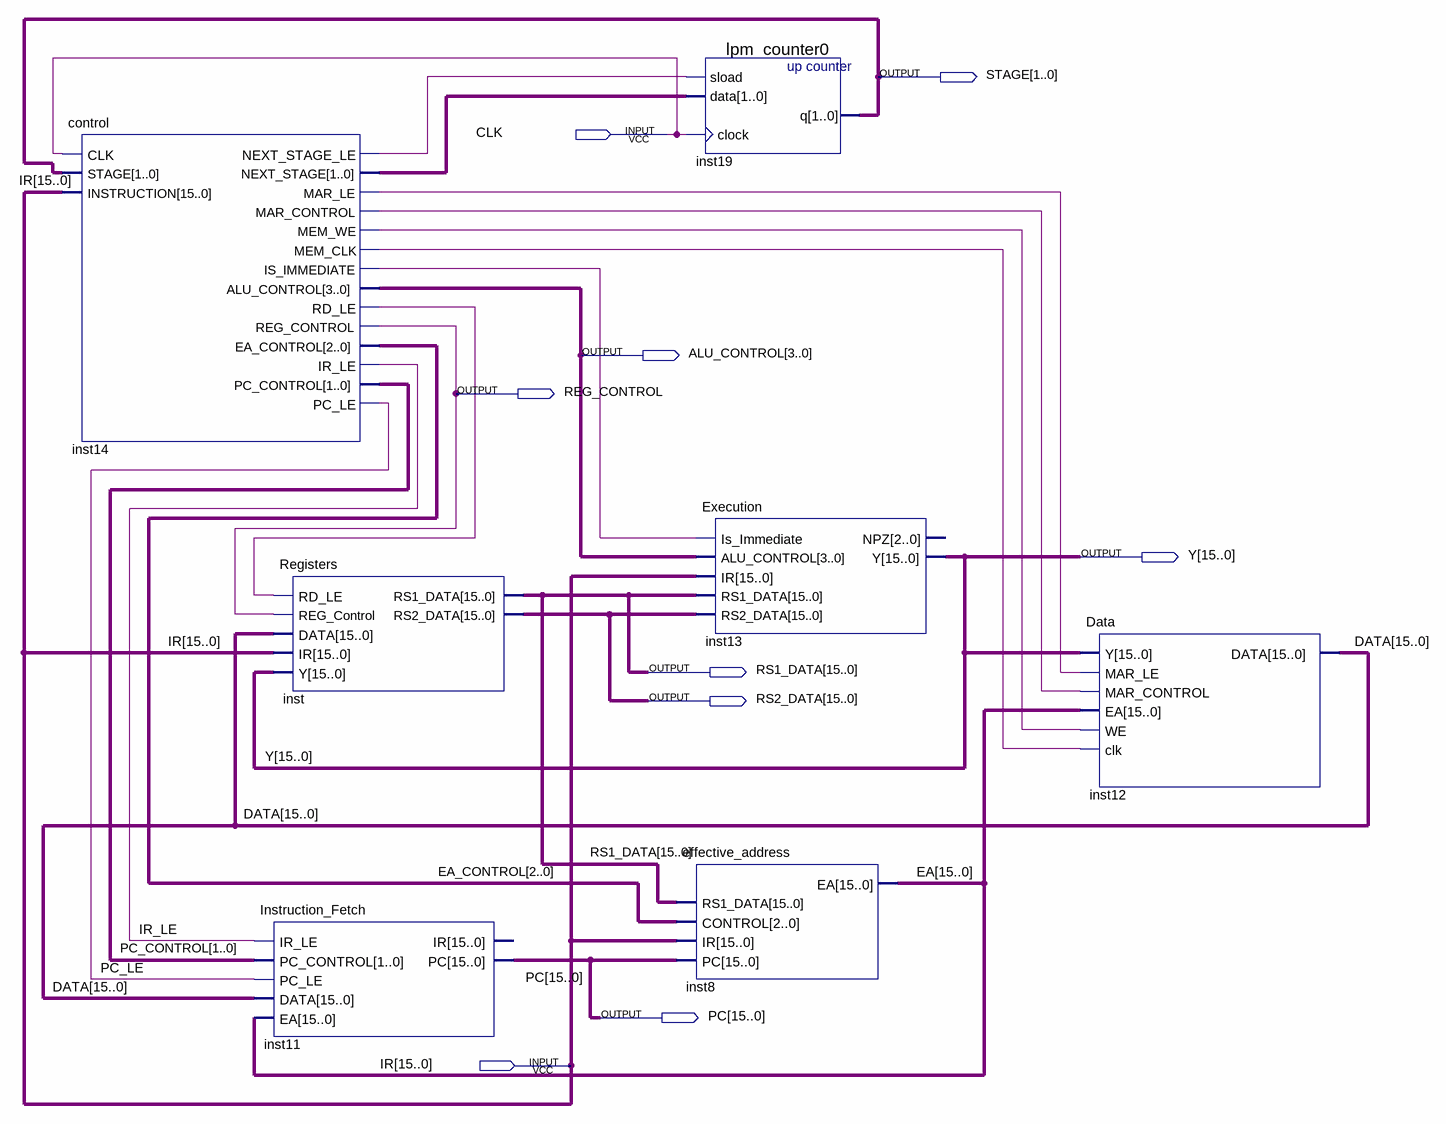
[diagram p0: schematic sheet]
// Quartus schematic LC3.bdf as structural Verilog: 7 symbols, 9 pins
module LC3 (
  input  CLK,
  input  [15:0] IR,
  output [1:0] STAGE,
  output [3:0] ALU_CONTROL,
  output REG_CONTROL,
  output [15:0] Y,
  output [15:0] RS1_DATA,
  output [15:0] RS2_DATA,
  output [15:0] PC
);

  wire inst14_is_immediate, inst14_mar_control, inst14_mar_le, inst14_mem_clk, inst14_mem_we,
       inst14_next_stage_le, inst14_rd_le, IR_LE, PC_LE;
  wire [1:0] inst14_next_stage, PC_CONTROL;
  wire [2:0] EA_CONTROL;
  wire [15:0] DATA, EA;

  control inst14 (
    .CLK(CLK), .STAGE(STAGE), .INSTRUCTION(IR), .NEXT_STAGE_LE(inst14_next_stage_le),
    .NEXT_STAGE(inst14_next_stage), .MAR_LE(inst14_mar_le), .MAR_CONTROL(inst14_mar_control),
    .MEM_WE(inst14_mem_we), .MEM_CLK(inst14_mem_clk), .IS_IMMEDIATE(inst14_is_immediate),
    .ALU_CONTROL(ALU_CONTROL), .RD_LE(inst14_rd_le), .REG_CONTROL(REG_CONTROL), .EA_CONTROL(EA_CONTROL),
    .IR_LE(IR_LE), .PC_CONTROL(PC_CONTROL), .PC_LE(PC_LE));
  Instruction_Fetch inst11 (
    .IR_LE(IR_LE), .PC_CONTROL(PC_CONTROL), .PC_LE(PC_LE), .EA(EA), .DATA(DATA), .PC(PC));  // open: IR
  Registers inst (
    .RD_LE(inst14_rd_le), .REG_Control(REG_CONTROL), .DATA(DATA), .IR(IR), .Y(Y), .RS1_DATA(RS1_DATA),
    .RS2_DATA(RS2_DATA));
  lpm_counter0 inst19 (.sload(inst14_next_stage_le), .data(inst14_next_stage), .clock(CLK), .q(STAGE));
  Execution inst13 (
    .Is_Immediate(inst14_is_immediate), .ALU_CONTROL(ALU_CONTROL), .IR(IR), .RS1_DATA(RS1_DATA),
    .RS2_DATA(RS2_DATA), .Y(Y));  // open: NPZ
  effective_address inst8 (.PC(PC), .RS1_DATA(RS1_DATA), .CONTROL(EA_CONTROL), .IR(IR), .EA(EA));
  Data inst12 (
    .Y(Y), .MAR_LE(inst14_mar_le), .MAR_CONTROL(inst14_mar_control), .EA(EA), .WE(inst14_mem_we),
    .clk(inst14_mem_clk), .DATA(DATA));
endmodule
